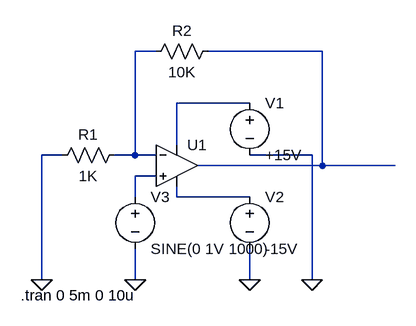
[diagram p0: schematic Non Inverting amplifier.asc]
Non Inverting amplifier.asc, the LTspice schematic file:
Version 4.1
SHEET 1 880 680
WIRE 112 0 80 0
WIRE 368 0 192 0
WIRE 256 80 144 80
WIRE 144 144 144 80
WIRE -32 160 -64 160
WIRE 80 160 80 0
WIRE 80 160 48 160
WIRE 112 160 80 160
WIRE 352 160 256 160
WIRE 368 176 368 0
WIRE 368 176 176 176
WIRE 480 176 368 176
WIRE 112 192 80 192
WIRE 80 224 80 192
WIRE 144 224 144 208
WIRE 256 224 144 224
WIRE -64 352 -64 160
WIRE 80 352 80 304
WIRE 256 352 256 304
WIRE 352 352 352 160
FLAG -64 352 0
FLAG 80 352 0
FLAG 256 352 0
FLAG 352 352 0
SYMBOL res 64 144 R90
WINDOW 0 0 56 VBottom 2
WINDOW 3 32 56 VTop 2
SYMATTR InstName R1
SYMATTR Value 1K
SYMBOL voltage 256 64 R0
WINDOW 123 0 0 Left 0
WINDOW 39 0 0 Left 0
SYMATTR InstName V1
SYMATTR Value +15V
SYMBOL voltage 256 208 R0
SYMATTR InstName V2
SYMATTR Value -15V
SYMBOL res 208 -16 R90
WINDOW 0 0 56 VBottom 2
WINDOW 3 32 56 VTop 2
SYMATTR InstName R2
SYMATTR Value 10K
SYMBOL voltage 80 208 R0
WINDOW 123 0 0 Left 0
WINDOW 39 0 0 Left 0
SYMATTR InstName V3
SYMATTR Value SINE(0 1V 1000)
SYMBOL OpAmps\\UniversalOpAmp2 144 176 R0
SYMATTR InstName U1
TEXT -96 376 Left 2 !.tran 0 5m 0 10u

The netlist it stands for:
* Non Inverting amplifier.asc
R1 N001 0 1K
V1 N003 0 +15V
V2 N005 0 -15V
R2 N002 N001 10K
V3 N004 0 SINE(0 1V 1000)
X§U1 N004 N001 N003 N005 N002 level2 Avol=1Meg GBW=10Meg Slew=10Meg Ilimit=25m Rail=0 Vos=0 En=0 Enk=0 In=0 Ink=0 Rin=500Meg  ; pins In+ In- V+ V- OUT
.tran 0 5m 0 10u
.lib UniversalOpAmp2.lib
.backanno
.end